# EAGLE design 3S2Pcard (EAGLE 9.5.1)

## Sheet 1 of 3
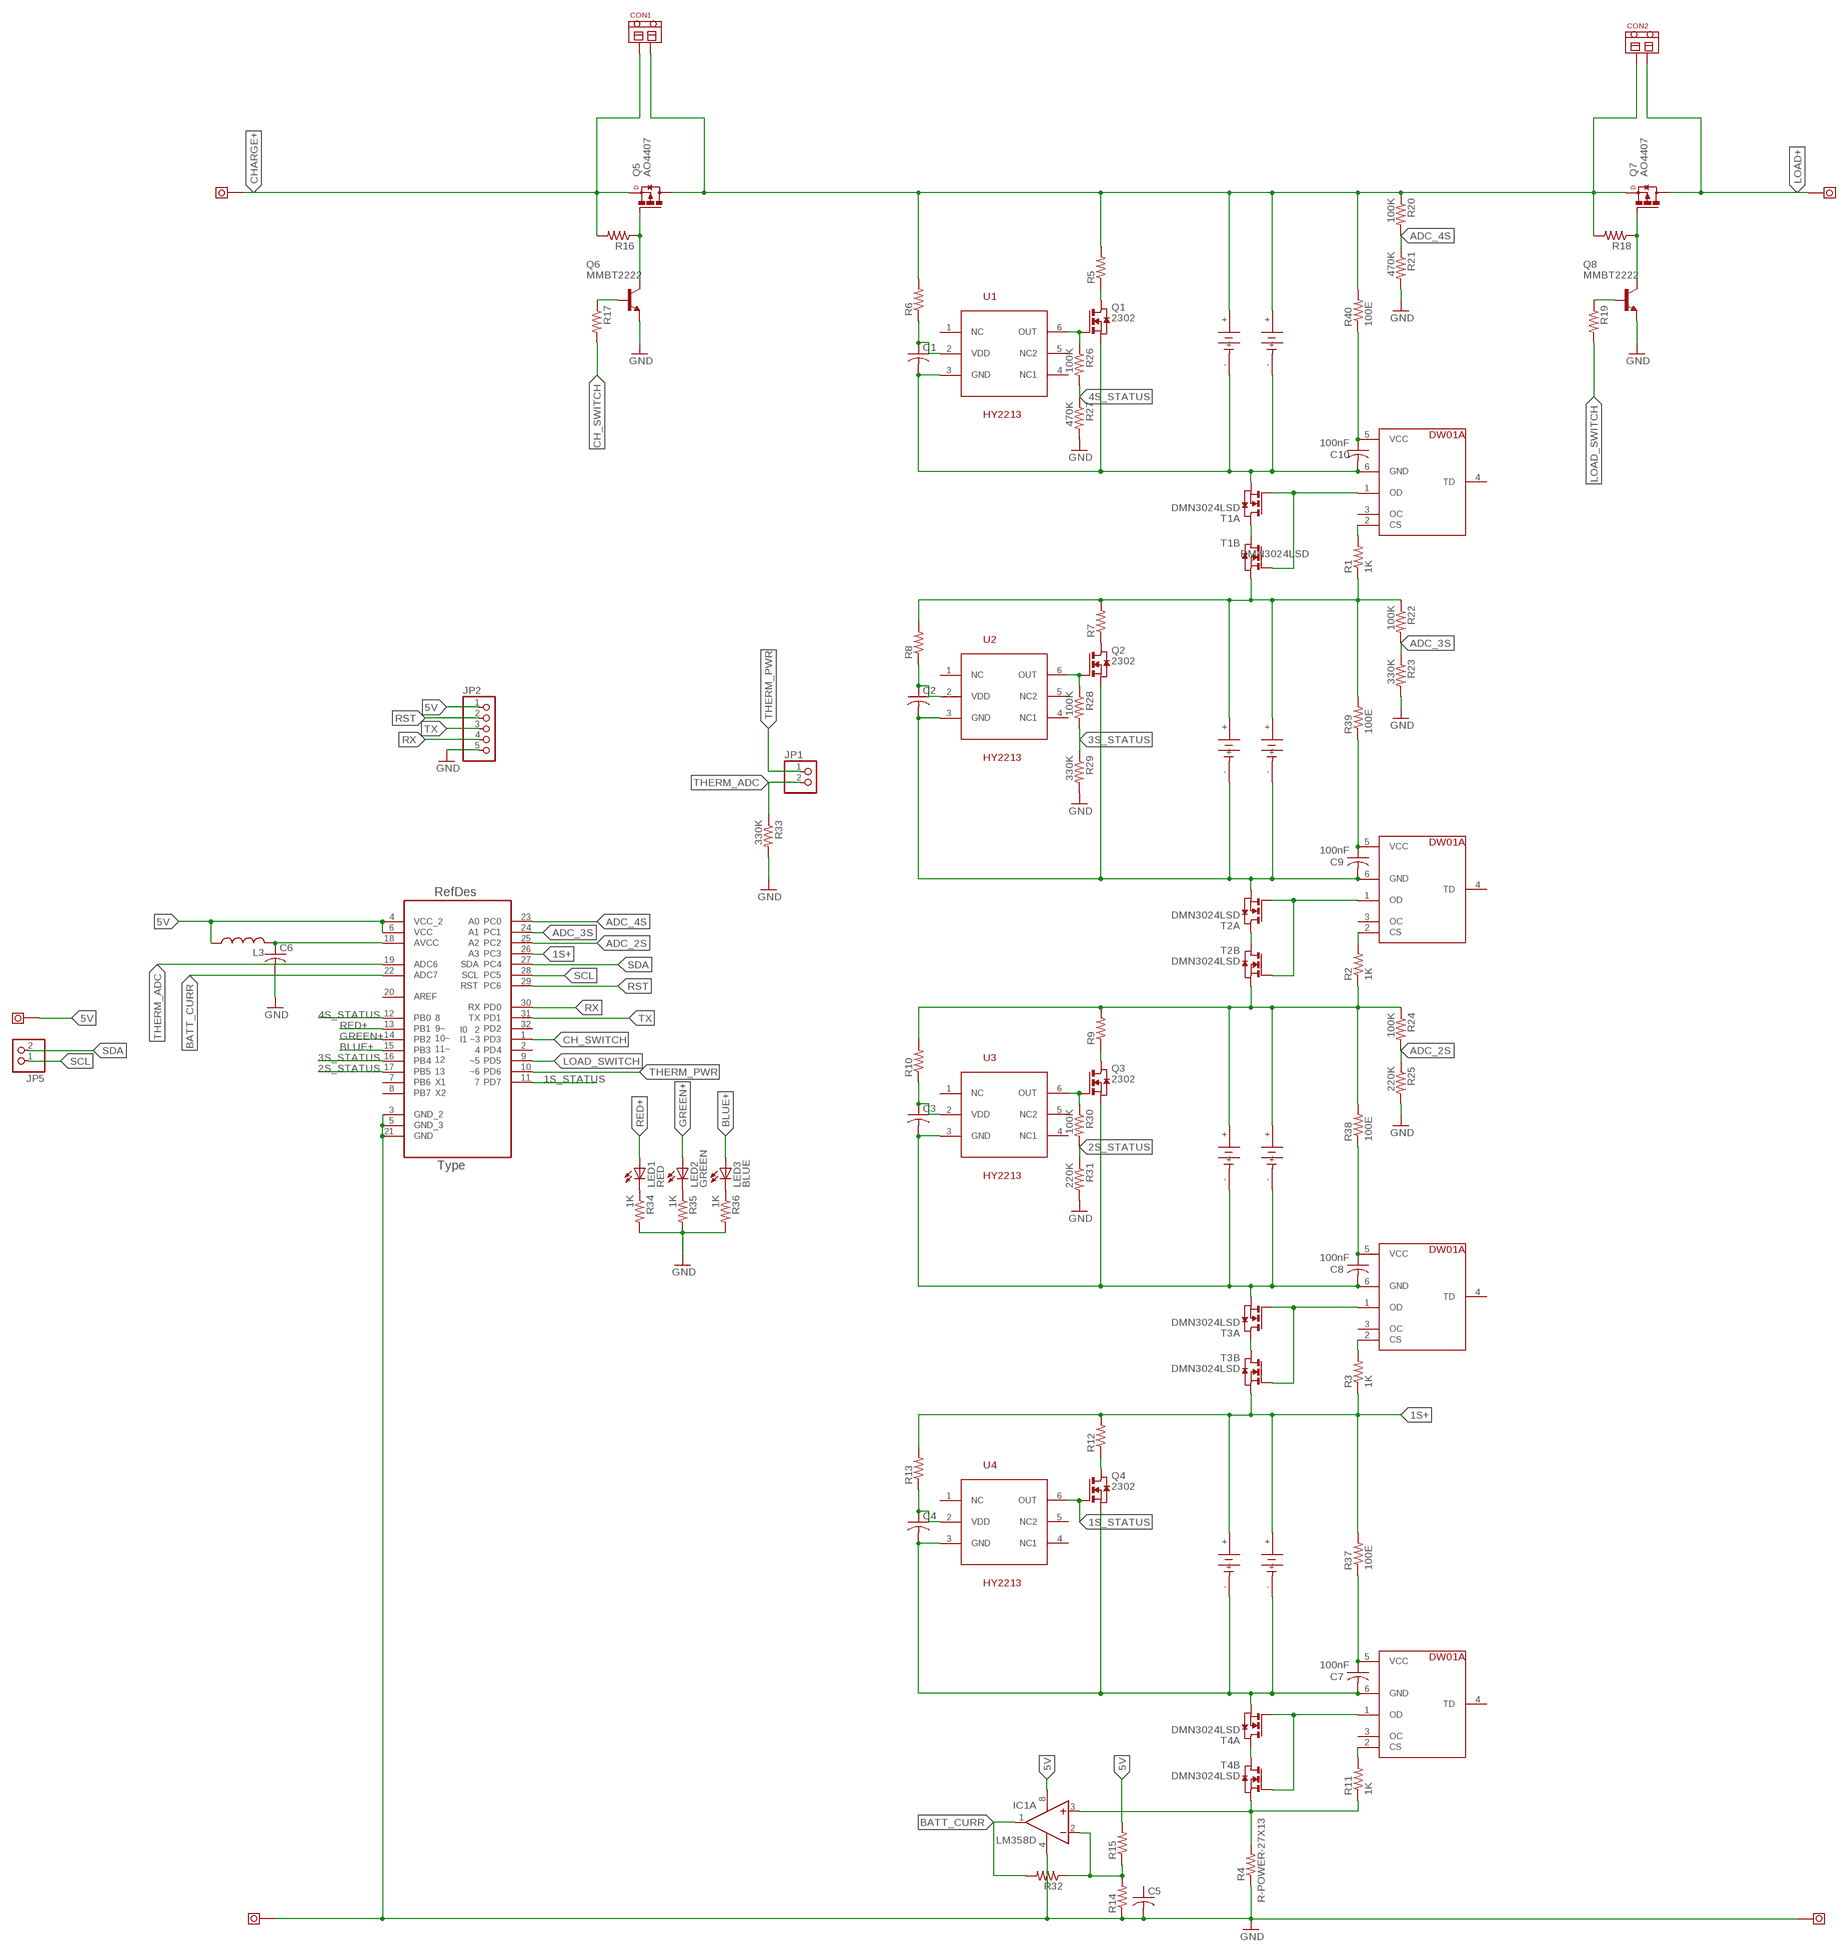
[diagram p0: schematic, sheet 1]

### Parts
B11  18650_HOLDER  [18650_HOLDER]
B12  18650_HOLDER  [18650_HOLDER]
B21  18650_HOLDER  [18650_HOLDER]
B22  18650_HOLDER  [18650_HOLDER]
B31  18650_HOLDER  [18650_HOLDER]
B32  18650_HOLDER  [18650_HOLDER]
B41  18650_HOLDER  [18650_HOLDER]
B42  18650_HOLDER  [18650_HOLDER]
C1  C-USC0805  [C0805]
C2  C-USC0805  [C0805]
C3  C-USC0805  [C0805]
C4  C-USC0805  [C0805]
C5  C-USC0805  [C0805]
C6  C-USC0805  [C0805]
C7  100nF  C-USC0805  [C0805]
C8  100nF  C-USC0805  [C0805]
C9  100nF  C-USC0805  [C0805]
C10  100nF  C-USC0805  [C0805]
CON1  TERMINAL-SMALL  [TERMINAL-SMALL]
CON2  TERMINAL-SMALL  [TERMINAL-SMALL]
IC1  LM358D  [SO08]
JP1  PINHD-1X2  [1X02]
JP2  PINHD-1X5  [1X05]
JP5  PINHD-1X2  [1X02]
L3  L-US0207/10  [0207/10]
LED1  RED  LEDCHIP-LED0805  [CHIP-LED0805]
LED2  GREEN  LEDCHIP-LED0805  [CHIP-LED0805]
LED3  BLUE  LEDCHIP-LED0805  [CHIP-LED0805]
Q1  2302  [TO236]
Q2  2302  [TO236]
Q3  2302  [TO236]
Q4  2302  [TO236]
Q5  AO4407  [SOIC8]
Q6  MMBT2222  [SOT-23-CBE]
Q7  AO4407  [SOIC8]
Q8  MMBT2222  [SOT-23-CBE]
R1  1K  R-US_R0805  [R0805]
R2  1K  R-US_R0805  [R0805]
R3  1K  R-US_R0805  [R0805]
R4  R-POWER-27X13  [R-27X13]
R5  R-US_R1206W  [R1206W]
R6  R-US_R0805  [R0805]
R7  R-US_R1206W  [R1206W]
R8  R-US_R0805  [R0805]
R9  R-US_R1206W  [R1206W]
R10  R-US_R0805  [R0805]
R11  1K  R-US_R0805  [R0805]
R12  R-US_R1206W  [R1206W]
R13  R-US_R0805  [R0805]
R14  R-US_R0805  [R0805]
R15  R-US_R0805  [R0805]
R16  R-US_R0805  [R0805]
R17  R-US_R0805  [R0805]
R18  R-US_R0805  [R0805]
R19  R-US_R0805  [R0805]
R20  100K  R-US_R0805  [R0805]
R21  470K  R-US_R0805  [R0805]
R22  100K  R-US_R0805  [R0805]
R23  330K  R-US_R0805  [R0805]
R24  100K  R-US_R0805  [R0805]
R25  220K  R-US_R0805  [R0805]
R26  100K  R-US_R0805  [R0805]
R27  470K  R-US_R0805  [R0805]
R28  100K  R-US_R0805  [R0805]
R29  330K  R-US_R0805  [R0805]
R30  100K  R-US_R0805  [R0805]
R31  220K  R-US_R0805  [R0805]
R32  R-US_R0805  [R0805]
R33  330K  R-US_R0805  [R0805]
R34  1K  R-US_R0805  [R0805]
R35  1K  R-US_R0805  [R0805]
R36  1K  R-US_R0805  [R0805]
R37  100E  R-US_R0805  [R0805]
R38  100E  R-US_R0805  [R0805]
R39  100E  R-US_R0805  [R0805]
R40  100E  R-US_R0805  [R0805]
T1  DMN3024LSD  [TSSOP-8]
T2  DMN3024LSD  [TSSOP-8]
T3  DMN3024LSD  [TSSOP-8]
T4  DMN3024LSD  [TSSOP-8]
U1  HY2213  [SOT23-6]
U2  HY2213  [SOT23-6]
U3  HY2213  [SOT23-6]
U4  HY2213  [SOT23-6]
U5  ATMEGA328P-AU  [QFP80P900X900X120-32N]
U12  DW01A  [SOT23-6]
U$7  DW01A  [SOT23-6]
U$8  DW01A  [SOT23-6]
U$9  DW01A  [SOT23-6]
U$13  METAL_SPACER  [SPACER]
U$14  METAL_SPACER  [SPACER]
U$15  METAL_SPACER  [SPACER]
U$16  METAL_SPACER  [SPACER]
U$17  METAL_SPACER  [SPACER]

### Nets
1S+: B11.+ B12.+ R3.1 R12.2 R13.2 R37.2 T3.6(B:S) T3.7(B:S) U5.26(PC3)
1S-: B11.- B12.- C4.2 C7.2 Q4.3(S) T4.2(A:S) T4.3(A:S) U4.3(GND) U12.6(GND)
1S_STATUS: Q4.2(G) U4.6(OUT) U5.11(PD7)
2S+: B21.+ B22.+ R2.1 R9.2 R10.2 R24.1 R38.2 T2.6(B:S) T2.7(B:S)
2S-: B21.- B22.- C3.2 C8.2 Q3.3(S) T3.2(A:S) T3.3(A:S) U3.3(GND) U$9.6(GND)
2S_STATUS: R30.2 R31.1 U5.17(PB5)
3S+: B31.+ B32.+ R1.1 R7.2 R8.2 R22.1 R39.2 T1.6(B:S) T1.7(B:S)
3S-: B31.- B32.- C2.2 C9.2 Q2.3(S) T2.2(A:S) T2.3(A:S) U2.3(GND) U$8.6(GND)
3S_STATUS: R28.2 R29.1 U5.16(PB4)
4S+: B41.+ B42.+ CON1.2 CON2.1 Q5.1(S) Q5.2(S) Q5.3(S) Q7.5(D) Q7.6(D) Q7.7(D) Q7.8(D) R5.2 R6.2 R18.2 R20.1 R40.2
4S-: B41.- B42.- C1.2 C10.2 Q1.3(S) T1.2(A:S) T1.3(A:S) U1.3(GND) U$7.6(GND)
4S_STATUS: R26.2 R27.1 U5.12(PB0)
5V: IC1.8(P:V+) JP2.1 L3.1 R15.2 U5.4(VCC_2) U5.6(VCC) U$17.1
ADC_2S: R24.2 R25.1 U5.25(PC2)
ADC_3S: R22.2 R23.1 U5.24(PC1)
ADC_4S: R20.2 R21.1 U5.23(PC0)
AVCC: C6.1 L3.2 U5.18(AVCC)
BATT_CURR: IC1.1(A:OUT) R32.2 U5.22(ADC7)
BLUE+: LED3.A U5.15(PB3)
CH_SWITCH: R17.2 U5.1(PD3)
CHARGE+: CON1.1 Q5.5(D) Q5.6(D) Q5.7(D) Q5.8(D) R16.2 U$15.1
GND: C5.2 C6.2 IC1.4(P:V-) JP2.5 Q6.E Q8.E R4.1 R14.1 R21.2 R23.2 R25.2 R27.2 R29.2 R31.2 R33.2 R34.2 R35.2 R36.2 U5.3(GND_2) U5.5(GND_3) U5.21(GND) U$14.1 U$16.1
GREEN+: LED2.A U5.14(PB2)
LOAD+: CON2.2 Q7.1(S) Q7.2(S) Q7.3(S) U$13.1
LOAD_SWITCH: R19.2 U5.9(PD5)
N$1: C7.1 R37.1 U12.5(VCC)
N$2: T1.1(A:D) T1.8(B:D)
N$3: C8.1 R38.1 U$9.5(VCC)
N$4: IC1.2(A:-IN) R14.2 R15.1 R32.1
N$5: T2.1(A:D) T2.8(B:D)
N$7: C9.1 R39.1 U$8.5(VCC)
N$8: C10.1 R40.1 U$7.5(VCC)
N$9: R1.2 U$7.2(CS)
N$10: T1.4(A:G) T1.5(B:G) U$7.1(OD)
N$11: R2.2 U$8.2(CS)
N$12: T3.1(A:D) T3.8(B:D)
N$14: T2.4(A:G) T2.5(B:G) U$8.1(OD)
N$15: LED1.C R34.1
N$16: LED2.C R35.1
N$17: T3.4(A:G) T3.5(B:G) U$9.1(OD)
N$18: R3.2 U$9.2(CS)
N$19: LED3.C R36.1
N$20: C1.1 R6.1 U1.2(VDD)
N$22: Q1.2(G) R26.1 U1.6(OUT)
N$23: Q1.1(D) R5.1
N$25: C2.1 R8.1 U2.2(VDD)
N$26: Q2.2(G) R28.1 U2.6(OUT)
N$27: Q2.1(D) R7.1
N$30: C3.1 R10.1 U3.2(VDD)
N$31: Q3.2(G) R30.1 U3.6(OUT)
N$32: Q3.1(D) R9.1
N$33: T4.1(A:D) T4.8(B:D)
N$34: T4.4(A:G) T4.5(B:G) U12.1(OD)
N$36: R11.2 U12.2(CS)
N$37: C4.1 R13.1 U4.2(VDD)
N$39: Q4.1(D) R12.1
N$40: IC1.3(A:+IN) R4.2 R11.1 T4.6(B:S) T4.7(B:S)
N$41: Q5.4(G) Q6.C R16.1
N$42: Q6.B R17.1
N$47: Q7.4(G) Q8.C R18.1
N$48: Q8.B R19.1
RED+: LED1.A U5.13(PB1)
RST: JP2.2 U5.29(PC6)
RX: JP2.4 U5.30(PD0)
SCL: JP5.1 U5.28(PC5)
SDA: JP5.2 U5.27(PC4)
THERM_ADC: JP1.2 R33.1 U5.19(ADC6)
THERM_PWR: JP1.1 U5.10(PD6)
TX: JP2.3 U5.31(PD1)
Unconnected: C5.1 IC1.5(B:+IN) IC1.6(B:-IN) IC1.7(B:OUT) U1.1(NC) U1.4(NC1) U1.5(NC2) U2.1(NC) U2.4(NC1) U2.5(NC2) U3.1(NC) U3.4(NC1) U3.5(NC2) U4.1(NC) U4.4(NC1) U4.5(NC2) U5.2(PD4) U5.7(PB6) U5.8(PB7) U5.20(AREF) U5.32(PD2) U12.3(OC) U12.4(TD) U$7.3(OC) U$7.4(TD) U$8.3(OC) U$8.4(TD) U$9.3(OC) U$9.4(TD)

## Sheet 2 of 3

## Sheet 3 of 3

## Library data of the parts
B11 B12 B21 B22 B31 B32 B41 B42 = drag-custom:18650_HOLDER
C1-C10 = rcl:C-US: CAPACITOR, American symbol; SPICEPREFIX: C
CON1 CON2 = drag-connectors:TERMINAL-SMALL: Small Terminal block Here is the link <http://terminals.btrworlds.com/terminal-block/connector-block-pitch-5-0-mm-22-14-awg-pcb-screw-terminal-block-connector-1404225.html>
IC1 = linear:LM358: OP AMP also LM158; LM258; LM2904 Source: http://cache.national.com/ds/LM/LM158.pdf
JP1 JP5 = pinhead:PINHD-1X2: PIN HEADER
JP2 = pinhead:PINHD-1X5: PIN HEADER
L3 = rcl:L-US: INDUCTOR, American symbol; SPICEPREFIX: L
LED1-LED3 = led:LED: LED OSRAM: - CHIPLED LG R971, LG N971, LY N971, LG Q971, LY Q971, LO R971, LY R971 LH N974, LH R974 LS Q976, LO Q976, LY Q976 LO Q996 - Hyper CHIPLED LW Q18S LB Q993, LB Q99A, LB R99A - SideLED LS A670, LO A670, LY A670, LG A670, LP A670 LB A673, LV A673, LT A673, LW A673 LH A674 LY A675 LS A676, LA A676, LO A676, LY A676, LW A676 LS A679, LY A679, LG A679 - Hyper Micro SIDELED® LS Y876, LA Y876, LO Y876, LY Y876 LT Y87S - SmartLED LW L88C, LW L88S LB L89C, LB L89S, LG L890 LS L89K, LO L89K, LY L89K LS L896, LA L896, LO L896, LY L896 - TOPLED LS T670, LO T670, LY T670, LG T670, LP T670 LSG T670, LSP T670, LSY T670, LOP T670, LYG T670 LG T671, LOG T671, LSG T671 LB T673, LV T673, LT T673, LW T673 LH T674 LS T676, LA T676, LO T676, LY T676, LB T676, LH T676, LSB T676, LW T676 LB T67C, LV T67C, LT T67C, LS T67K, LO T67K, LY T67K, LW E67C LS E67B, LA E67B, LO E67B, LY E67B, LB E67C, LV E67C, LT E67C LW T67C LS T679, LY T679, LG T679 LS T770, LO T770, LY T770, LG T770, LP T770 LB T773, LV T773, LT T773, LW T773 LH T774 LS E675, LA E675, LY E675, LS T675 LS T776, LA T776, LO T776, LY T776, LB T776 LHGB T686 LT T68C, LB T68C - Hyper Mini TOPLED® LB M676 - Mini TOPLED Santana® LG M470 LS M47K, LO M47K, LY M47K Source: http://www.osram.convergy.de LUXEON: - LUMILED® LXK2-PW12-R00, LXK2-PW12-S00, LXK2-PW14-U00, LXK2-PW14-V00 LXK2-PM12-R00, LXK2-PM12-S00, LXK2-PM14-U00 LXK2-PE12-Q00, LXK2-PE12-R00, LXK2-PE12-S00, LXK2-PE14-T00, LXK2-PE14-U00 LXK2-PB12-K00, LXK2-PB12-L00, LXK2-PB12-M00, LXK2-PB14-N00, LXK2-PB14-P00, LXK2-PB14-Q00 LXK2-PR12-L00, LXK2-PR12-M00, LXK2-PR14-Q00, LXK2-PR14-R00 LXK2-PD12-Q00, LXK2-PD12-R00, LXK2-PD12-S00 LXK2-PH12-R00, LXK2-PH12-S00 LXK2-PL12-P00, LXK2-PL12-Q00, LXK2-PL12-R00 Source: www.luxeon.com KINGBRIGHT: KA-3528ASYC Source: www.kingbright.com
Q1-Q4 = drag-semiconductors:2302
Q5 Q7 = drag-semiconductors:AO4407
Q6 Q8 = drag-semiconductors:MMBT2222
R1-R3 R5-R40 = rcl:R-US_: RESISTOR, American symbol; SPICEPREFIX: R
R4 = drag-rlcd:R-POWER-27X13
T1-T4 = FS8205A:DMN3024LSD: DUAL N-CHANNEL ENHANCEMENT MODE MOSFET data sheet <http://goo.gl/dRgboR> Dave.Calaway Eagle Library <https://goo.gl/Muy1Tr>
U1-U4 = drag-semiconductors:HY2213: Balance Charging IC
U5 = ATmega328-AU:ATMEGA328P-AU; DESCRIPTION: 8-bit Microcontroller with In-System Programmable Flash; MPN: ATMEGA328P-AU; OC_FARNELL: 1715486; OC_NEWARK: 14R4631; PACKAGE: TQFP-32; SUPPLIER: Atmel
U12 U$7-U$9 = DW01A:DW01A
U$13-U$17 = drag-custom:METAL_SPACER

## Board
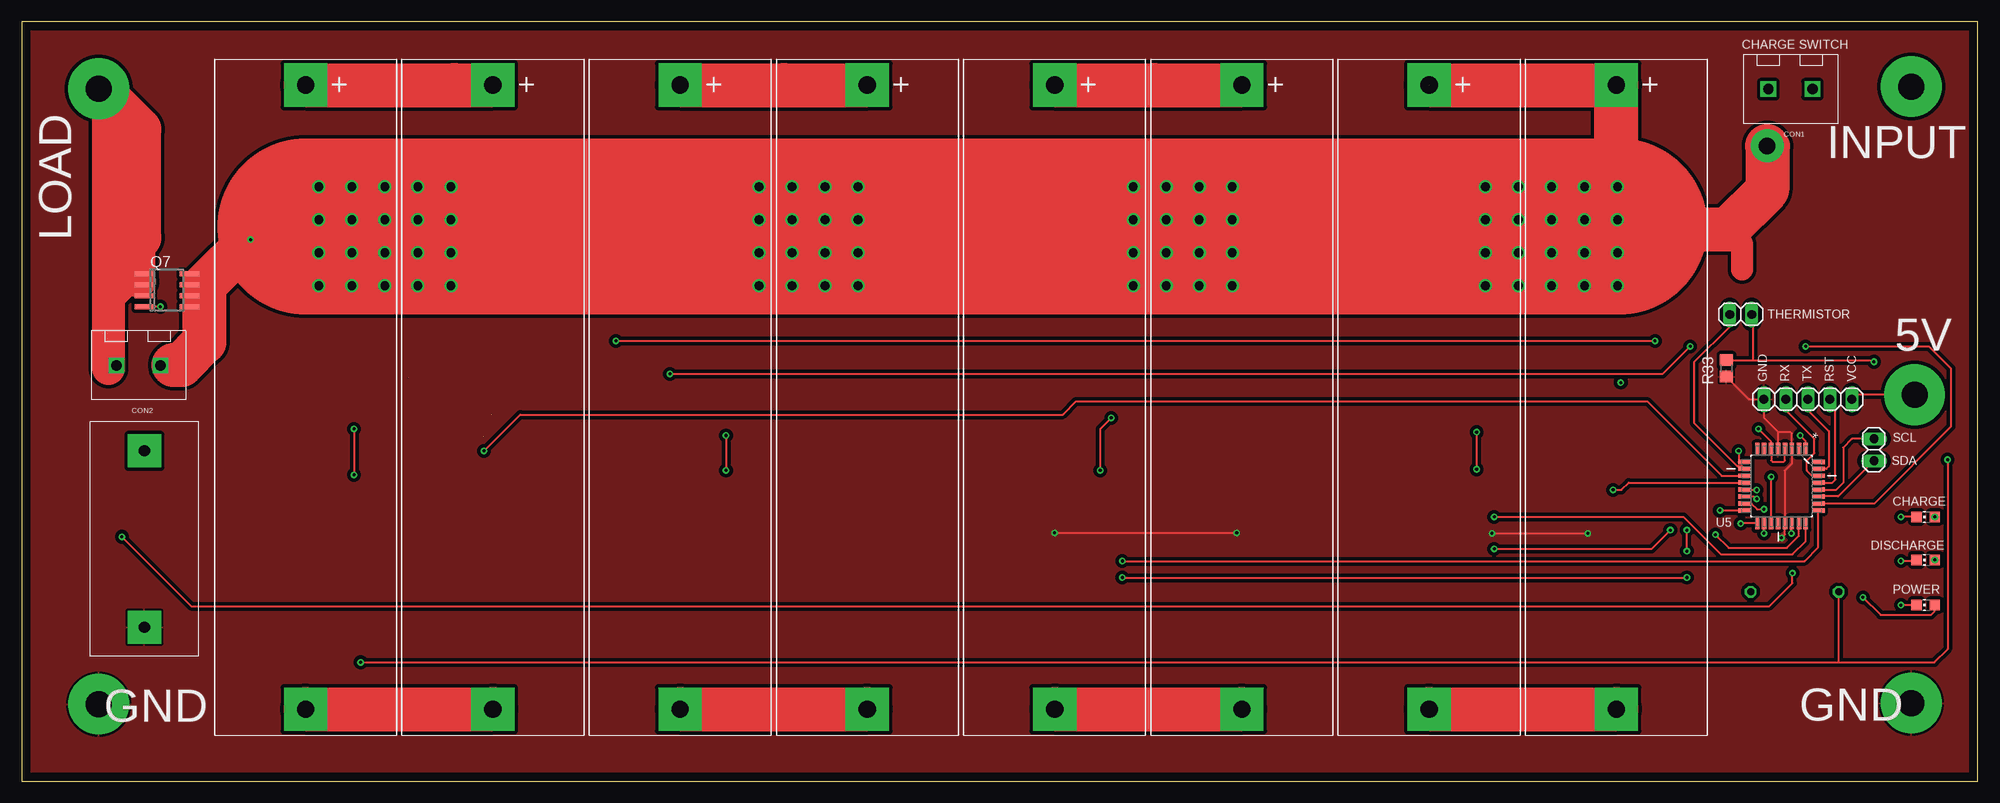
[diagram p1: board, top side]
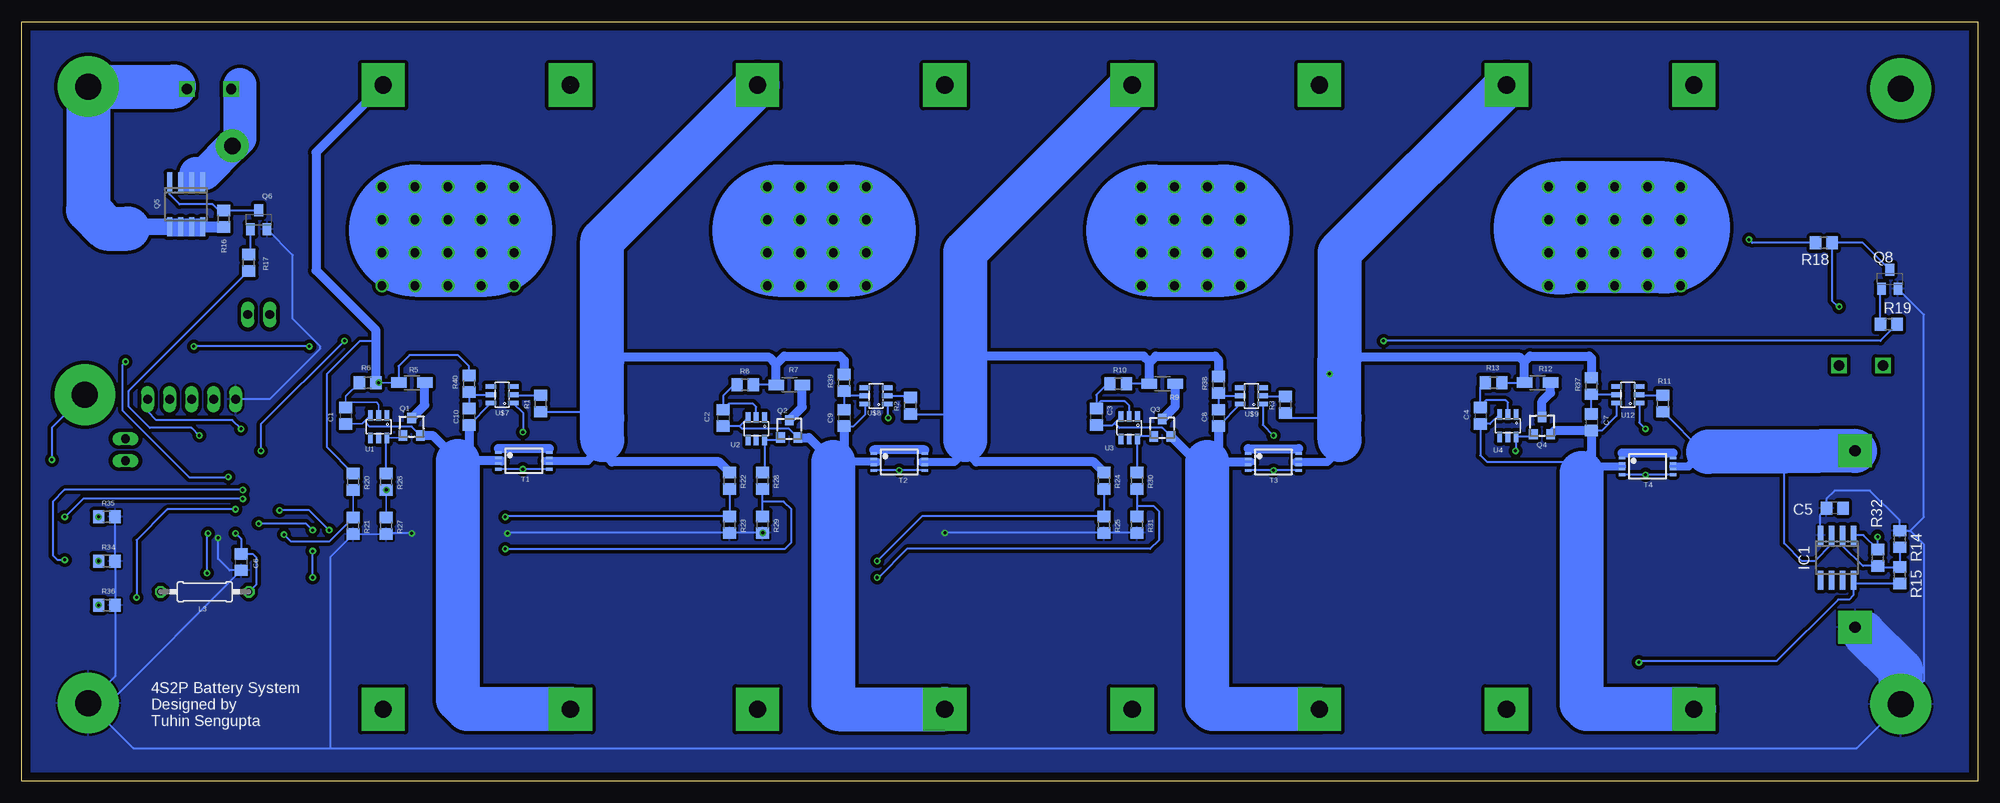
[diagram p2: board, bottom side, seen from below]

Size 225.73 x 87.62 mm. Coordinates in mm from the lower left corner, seen from the top.
Outline: 0,0 225.73,0 225.73,87.62 0,87.62 0,0
Copper layers (1*16): Top 0.035mm / dielectric 1.5mm / Bottom 0.035mm
Design rules "default": minimum track width 6mil, minimum drill 0.35mm, track to track 6mil, track to pad 6mil, pad to pad 6mil, via to via 6mil, smd to smd 6mil, copper to edge 40mil, drill to drill 6mil, minimum pad ring 10mil, minimum via ring 8mil, stop-mask expansion 4mil, vias tented up to drill 0mil, thermal gap 10mil

### Footprints (pad centres in the part's own frame; a part is rotated, then mirrored left to right if it is on the bottom)
18650_HOLDER = drill 2 pad 5 square: + -0.93,38.17; - -0.93,-33.83
C0805 = smd 1.3 x 1.5: 1 -0.95,0; 2 0.95,0
TERMINAL-SMALL = drill 1.2 square: 1 -2.165,0.165; 2 2.915,0.165
SO08 = smd 0.6 x 2.2: 1 -1.905,-2.6; 2 -0.635,-2.6; 3 0.635,-2.6; 4 1.905,-2.6; 5 1.905,2.6; 6 0.635,2.6; 7 -0.635,2.6; 8 -1.905,2.6
1X02 = drill 1.016 long: 1 -1.27,0; 2 1.27,0
1X05 = drill 1.016 long: 1 -5.08,0; 2 -2.54,0; 3 0,0; 4 2.54,0; 5 5.08,0
0207/10 = drill 0.813 octagon: 1 -5.08,0; 2 5.08,0
CHIP-LED0805 = smd 1.2 x 1.2: A 0,-1.05; C 0,1.05
TO236 = smd 1 x 1.2: 1 0,1; 2 -1,-1; 3 1,-1
SOIC8 = smd 0.6 x 2.2: 1 -1.905,-2.6; 2 -0.635,-2.6; 3 0.635,-2.6; 4 1.905,-2.6; 5 1.905,2.6; 6 0.635,2.6; 7 -0.635,2.6; 8 -1.905,2.6
SOT-23-CBE = smd 1 x 1.4: B -0.95,-1.1; C 0,1.1; E 0.95,-1.1
R0805 = smd 1.3 x 1.5: 1 -0.95,0; 2 0.95,0
R-27X13 = drill 1.27 pad 3.81 square: 1 -10.63,-0.1; 2 9.69,-0.1
R1206W = smd 1.8 x 1.2: 1 -1.499,0; 2 1.499,0
TSSOP-8 = smd 0.3 x 0.75: 1 -0.975,-2.925; 2 -0.325,-2.925; 3 0.325,-2.925; 4 0.975,-2.925; 5 0.975,2.925; 6 0.325,2.925; 7 -0.325,2.925; 8 -0.975,2.925
SOT23-6 = smd 0.55 x 1.2: 1 -0.95,-1.3; 2 0,-1.3; 3 0.95,-1.3; 4 0.95,1.3; 5 0,1.3; 6 -0.95,1.3
QFP80P900X900X120-32N = smd 1.473 x 0.508: 1 -4.242,2.794; 2 -4.242,2.007; 3 -4.242,1.194; 4 -4.242,0.406; 5 -4.242,-0.406; 6 -4.242,-1.194; 7 -4.242,-2.007; 8 -4.242,-2.794; 17 4.242,-2.794; 18 4.242,-2.007; 19 4.242,-1.194; 20 4.242,-0.406; 21 4.242,0.406; 22 4.242,1.194; 23 4.242,2.007; 24 4.242,2.794 | smd 0.508 x 1.473: 9 -2.794,-4.242; 10 -2.007,-4.242; 11 -1.194,-4.242; 12 -0.406,-4.242; 13 0.406,-4.242; 14 1.194,-4.242; 15 2.007,-4.242; 16 2.794,-4.242; 25 2.794,4.242; 26 2.007,4.242; 27 1.194,4.242; 28 0.406,4.242; 29 -0.406,4.242; 30 -1.194,4.242; 31 -2.007,4.242; 32 -2.794,4.242
SPACER = drill 3 pad 7: 1 0,0

### Placement (x,y rotation side)
B11  55.3,42.13 0 top
B12  33.7,42.13 0 top
B21  98.52,42.13 0 top
B22  76.91,42.13 0 top
B31  141.74,42.13 0 top
B32  120.13,42.13 0 top
B41  163.34,42.13 0 top
B42  184.95,42.13 0 top
C1  188.34,42.16 270 bottom
C2  144.78,41.91 270 bottom
C3  101.73,42.04 270 bottom
C4  57.4,42.16 270 bottom
C5  16.51,31.5 180 bottom
C6  200.41,25.27 270 bottom
C7  44.58,41.4 270 bottom
C8  87.63,41.91 270 bottom
C9  130.81,41.91 270 bottom
C10  174.12,42.04 270 bottom
CON1  204.47,80.01 180 top
CON2  13.84,48.13 180 top
IC1  16.26,25.78 180 bottom
JP1  198.37,53.85 0 top
JP2  206.12,44.07 180 top
JP5  213.74,38.23 270 top
L3  204.6,21.84 0 bottom
LED1  219.71,25.53 90 top
LED2  219.71,30.48 90 top
LED3  219.71,20.32 90 top
Q1  180.72,40.89 0 bottom
Q2  137.16,40.64 0 bottom
Q3  94.11,40.77 0 bottom
Q4  50.29,41.02 0 bottom
Q5  206.76,66.55 180 bottom
Q6  198.37,64.77 0 bottom
Q7  16.76,56.64 270 top
Q8  10.16,57.91 0 bottom
R1  165.86,43.56 90 bottom
R2  123.19,43.31 90 bottom
R3  79.88,43.43 90 bottom
R4  14.07,28.41 90 top
R5  180.72,45.97 180 bottom
R6  185.8,45.97 0 bottom
R7  137.16,45.72 180 bottom
R8  142.24,45.72 0 bottom
R9  94.11,45.85 180 bottom
R10  99.19,45.85 0 bottom
R11  36.32,43.56 90 bottom
R12  50.8,45.97 180 bottom
R13  55.88,45.97 0 bottom
R14  9.02,27.94 270 bottom
R15  9.02,23.75 270 bottom
R16  202.44,64.9 270 bottom
R17  199.52,59.82 270 bottom
R18  17.78,62.1 180 bottom
R19  10.29,52.7 0 bottom
R20  187.45,34.54 270 bottom
R21  187.45,29.46 270 bottom
R22  144.02,34.67 270 bottom
R23  144.02,29.59 270 bottom
R24  100.84,34.67 270 bottom
R25  100.84,29.59 270 bottom
R26  183.64,34.54 270 bottom
R27  183.64,29.46 270 bottom
R28  140.21,34.67 270 bottom
R29  140.21,29.59 270 bottom
R30  97.03,34.67 270 bottom
R31  97.03,29.59 270 bottom
R32  11.56,25.78 90 bottom
R33  196.72,47.62 270 top
R34  215.9,25.4 0 bottom
R35  215.9,30.48 0 bottom
R36  215.9,20.32 0 bottom
R37  44.58,45.59 90 bottom
R38  87.63,45.72 90 bottom
R39  130.81,45.97 90 bottom
R40  174.12,45.85 90 bottom
T1  167.77,36.96 270 bottom
T2  124.46,36.83 270 bottom
T3  81.28,36.83 270 bottom
T4  38.1,36.32 270 bottom
U1  184.53,40.89 180 bottom
U2  140.97,40.64 180 bottom
U3  97.92,40.77 180 bottom
U4  54.23,41.02 180 bottom
U5  203.07,34.04 270 top
U12  40.39,44.58 90 bottom
U$7  170.31,44.58 90 bottom
U$8  127.13,44.45 90 bottom
U$9  83.82,44.45 90 bottom
U$13  8.89,79.88 0 top
U$14  218.06,9.02 0 top
U$15  218.06,80.14 0 top
U$16  8.89,8.89 0 top
U$17  218.44,44.58 0 top

### Tracks (layer width: path | path; a pad name or v marks a point on that pad's centre or on a via)
1S+  (via drill 0.35)  (1 unrouted)
  Top 0.203: v74.8,46.99 189.36,46.99 v192.53,50.16 | v205.87,50.16 220.09,50.16 222.63,47.62 222.63,40.89 213.77,32.03 U5.26
  Top 0.94: 49.91,80.14 49.91,80.3
  Top 5.08: B12.+ 49.91,80.3 B11.+
  Bottom 0.203: R12.2 R13.2 54.93,46.42 | 43.88,45.85 R37.2 44.58,46.86 44.58,47.12 | 79.88,42.16 R3.1 79.31,41.91 73.66,41.91 | 78.03,36.83 77.47,36.83 | 78.03,36.83 T3.7 | 78.03,36.83 T3.6 | v192.53,50.16 v205.87,50.16
  Bottom 0.94: 78.74,36.83 77.47,36.83 75.06,36.83 73.66,38.23 73.66,39.37
  Bottom 1.016: 34.52,78.55 B12.+ | R12.2 52.3,48.36 | 52.3,48.36 52.83,48.9 73.53,48.9 73.66,48.77 74.8,47.62 v74.8,46.99 | 52.3,48.36 52.3,48.41 51.69,49.02 44.83,49.02 44.58,48.77 44.58,46.86
  Bottom 5.08: B11.+ 73.66,61.01 73.66,48.77 73.66,41.91 73.66,39.37
1S-
  Top 5.08: B12.- B11.-
  Bottom 0.203: T4.2 41.02,36.32 T4.3 | 44.48,37.82 44.61,37.94 44.77,38.1 | U4.3 56.29,41.21 C4.2 57.4,37.59 56.64,36.83 47.5,36.83 47.24,37.08 47.12,37.08 45.72,35.69 | U12.6 41.69,42.13 43.37,40.45 C7.2
  Bottom 0.94: 44.58,36.07 44.32,36.32 41.02,36.32
  Bottom 1.016: 44.58,36.83 C7.2 48.86,40.45 Q4.3 | 44.58,36.83 44.58,36.07 | 45.72,35.56 45.72,35.69 | 45.72,35.69 44.58,36.83 | 45.72,35.69 45.72,36.83 44.61,37.94
  Bottom 5.08: B12.- 45.13,8.3 45.72,8.89 45.72,35.56
1S_STATUS  (via drill 0.35)  (1 unrouted)
  Top 0.203: v53.34,38.1 57.53,42.29 120.14,42.29 121.67,43.81 187.58,43.81 196.16,35.23 U5.11
  Bottom 0.203: Q4.2 51.55,39.77 53.23,39.77 U4.6 53.28,38.16 v53.34,38.1
2S+
  Top 0.94: 87.92,80.3 87.63,80.01 88.52,79.12 94.11,79.12
  Top 5.08: B22.+ B21.+ 87.92,80.3
  Bottom 0.203: R9.2 R10.2 | 87.19,46.23 R38.2 | T2.6 121.21,36.83 T2.7 121.59,37.16 121.92,36.83 | 122.74,41.91 R2.1 117.66,42.36 116.84,43.18
  Bottom 0.94: 116.84,39.37 116.84,38.1 118.11,36.83 121.92,36.83
  Bottom 1.016: 77.7,78.58 B22.+ | R9.2 95.61,48.26 | 95.61,48.26 95.61,48.36 96.27,49.02 116.71,49.02 116.84,48.9 | 95.61,48.26 94.84,49.02 88.01,49.02 87.63,48.64 R38.2 | R24.1 102.05,36.83 115.57,36.83 116.84,38.1
  Bottom 5.08: 116.84,39.37 116.84,43.18 116.84,48.9 116.84,61.05 B21.+
2S-
  Top 5.08: B22.- B21.-
  Bottom 0.203: U3.3 99.61,41.32 | 99.61,41.32 99.91,41.02 101.66,41.02 | 101.66,41.02 C3.2 | 101.73,40.95 101.66,41.02 | U$9.6 85.12,43.47 C8.2 | 84.53,36.83 T3.2 | 84.58,36.83 84.53,36.83 | 84.53,36.83 T3.3 | Q3.3 94.11,40.77 99.06,40.77 99.61,41.32
  Bottom 0.889: 84.58,36.83 83.82,36.83
  Bottom 1.016: 75.2,9.08 B22.- | C8.2 87.63,36.83 | B21.- 99.06,9.77 | 87.63,36.83 88.9,36.83 90.17,36.83 Q3.3 | 87.63,36.83 84.58,36.83
  Bottom 5.08: B22.- 88.31,8.3 88.9,8.89 88.9,36.83
2S_STATUS  (via drill 0.35)
  Top 0.203: v127,23.5 v192.15,23.5 192.28,23.5 | v192.15,26.54 v192.15,28.96 | v198.37,29.72 198.45,29.79 U5.17
  Bottom 0.203: R30.2 97.03,31.75 | 97.03,31.75 R31.1 | v127,23.5 126.87,23.5 123.57,26.8 95.5,26.8 94.49,27.81 94.49,31.11 95.12,31.75 97.03,31.75 | v192.15,23.5 v192.15,26.54 | v192.15,28.96 192.91,29.72 v198.37,29.72
3S+
  Top 0.94: 135.09,80.3 130.68,80.3
  Top 5.08: B32.+ 130.68,80.3 B31.+
  Bottom 0.203: R7.2 R8.2 | 164.77,36.96 163.96,36.96 164.28,37.28 T1.7 | 164.77,36.96 164.84,37.03 T1.7 | 164.77,36.96 164.84,36.89 T1.6 | R1.1 159.45,42.61 158.75,41.91 | T1.7 165.03,37.28 165.35,36.96 | T1.7 164.77,37.21 164.77,36.96
  Bottom 0.94: 165.35,36.96 164.77,36.96 163.96,36.96 160.4,36.96 158.75,38.61 158.75,39.37
  Bottom 1.016: 120.88,78.62 B32.+ | 142.47,78.64 B31.+ | R7.2 138.66,48.11 | 138.66,48.11 139.45,48.9 158.37,48.9 158.75,48.51 | 138.66,48.11 137.75,49.02 131.32,49.02 130.81,48.51 R39.2 | R22.1 145.23,36.83 157.61,36.83 158.75,37.97 158.75,39.37
  Bottom 5.08: B31.+ 158.75,62.36 158.75,48.51 158.75,41.91 158.75,39.37
3S-
  Top 5.08: B32.- B31.-
  Bottom 0.203: U2.3 142.9,40.96 | 142.9,40.96 C2.2 | U$8.6 128.43,42.26 129.79,40.89 130.74,40.89 C9.2 | Q2.3 137.16,40.64 142.58,40.64 142.9,40.96 | 127,36.83 127.06,36.83 T2.2 T2.3
  Bottom 0.94: 132.08,36.83 130.81,36.83 127,36.83
  Bottom 1.016: 118.38,9.12 B32.- | C9.2 130.81,36.83 | 139.97,9.14 B31.- | Q2.3 134.89,39.64 132.08,36.83
  Bottom 3.81: 132.08,8.89 131.49,8.3
  Bottom 5.08: 132.08,36.83 132.08,8.89 | 131.49,8.3 B32.-
3S_STATUS  (via drill 0.35)
  Top 0.203: v169.93,26.8 188.09,26.8 v190.25,28.96 | v195.96,31.24 U5.16
  Bottom 0.203: R29.1 140.21,32.26 | 140.21,32.26 R28.2 | v190.25,28.96 192.53,31.24 v195.96,31.24 | v169.93,26.8 137.67,26.8 136.91,27.56 136.91,31.37 137.79,32.26 140.21,32.26
4S+  (via drill 0.35, 1.91 pad 3.81)  (1 unrouted)
  Top 0.203: 21.08,56.9 21.08,57.15 21.08,58.67 19.49,58.67 Q7.8 Q7.7 Q7.6 Q7.5 | v26.42,62.48 31.24,62.48 32.77,64.01 | 17.53,48.01 16.05,48.01 CON2.1
  Top 2.54: 196.85,63.63 198.5,61.98 198.5,59.05
  Top 20.32: 32.77,64.01 178.05,64.01 184.4,64.01
  Top 3.81: v201.42,73.28 202.18,73.28
  Top 5.08: B41.+ B42.+ | 21.08,56.9 21.08,50.67 18.41,48.01 17.53,48.01 | B42.+ 184.02,70.48 190.88,63.63 196.85,63.63 201.42,68.2 v201.42,73.28 | 21.08,57.15 v26.42,62.48 | 178.05,64.01 184.02,69.98 B42.+
  Bottom 0.152: R5.2 v184.53,45.97 R6.2
  Bottom 0.203: 174.06,46.74 R40.2 174.12,47.88 175.39,49.15 180.97,49.15 182.25,47.88 182.25,46 R5.2 | v26.42,62.48 26.04,62.1 R18.2 | R20.1 190.5,38.54 190.5,46.99 186.69,50.8 184.85,50.8 | Q5.1 204.85,69.85 204.6,70.1 205.16,70.1 Q5.2 Q5.3 | 200.53,80.39 201.01,80.39 CON1.2
  Bottom 1.016: 164.06,78.66 B41.+ | R6.2 184.85,50.8 184.85,52.01 191.77,58.93 191.77,72.55 B42.+ 184.85,79.47
  Bottom 3.81: v201.42,73.28 204.6,70.1 205.61,70.1 | v201.42,73.28 200.91,73.79 | v201.42,73.28 200.53,74.17 200.53,80.39
4S-
  Top 5.08: B41.- B42.-
  Bottom 0.152: U1.3 186.16,41.51 186.46,41.21 C1.2
  Bottom 0.203: U$7.6 171.61,43.6 C10.2 | T1.2 170.63,37.28 170.31,36.96 170.63,36.63 T1.3 | Q1.3 180.72,40.89 185.55,40.89 186.16,41.51
  Bottom 1.016: C10.2 174.12,36.96 | 170.31,36.96 174.12,36.96 | 174.12,36.96 175.39,36.96 178.32,39.89 Q1.3
  Bottom 5.08: B41.- 174.29,8.3 175.39,9.4 175.39,36.96
4S_STATUS  (via drill 0.35)
  Top 0.203: R26.2 184.6,33.59 185.44,34.44 U5.12
  Bottom 0.152: R26.2 R27.1
  other vias: 183.64,33.59
5V  (via drill 0.35)
  Top 0.203: U$17.1 211.71,44.58 JP2.1 | U5.4 203.48,36.98 203.33,36.83 202.06,36.83 201.88,37.01 U5.6 201.88,39.17 v200.41,40.64 | v39.12,13.72 209.68,13.72 | 209.68,13.72 220.73,13.72 222.25,15.24 v222.25,37.08 | 209.68,13.72 L3.1
  Bottom 0.203: R15.2 13.97,22.8 IC1.8 14.35,21.46 14.86,20.95 16.13,20.95 23.2,13.88 23.2,13.84 39.12,13.84 v39.12,13.72 | v200.41,40.64 201.42,41.66 210.19,41.66 211.2,42.67 JP2.1 | U$17.1 222.25,40.77 v222.25,37.08
ADC_2S  (via drill 0.35)
  Top 0.203: v127,25.4 205.74,25.4 207.31,26.98 U5.25
  Bottom 0.203: R24.2 R25.1 121.86,30.54 v127,25.4
ADC_3S  (via drill 0.35)
  Top 0.203: v169.93,30.48 191.77,30.48 196.09,26.16 204.34,26.16 205.87,27.69 U5.24
  Bottom 0.203: R22.2 R23.1 169.87,30.54 v169.93,30.48
ADC_4S  (via drill 0.35)
  Top 0.203: 205.1,29.77 U5.23 205.08,28.3 203.71,26.92 196.98,26.92 v195.45,28.45
  Bottom 0.152: R21.1 R20.2
  Bottom 0.203: v195.45,28.45 194.69,27.69 190.18,27.69 R21.1
AVCC  (via drill 0.35)
  Top 0.203: v201.04,28.57 201.04,29.77 U5.18
  Bottom 0.203: v201.04,28.57 200.41,27.94 C6.1 200.34,26.16 199.01,26.16 198.63,25.78 198.63,22.73 L3.2
BATT_CURR  (via drill 0.35)
  Top 0.203: v11.56,28.19 19.56,20.19 201.68,20.19 204.34,22.86 v204.34,24 | v204.22,28.57 204.22,29.74 U5.22
  Bottom 0.203: 14.35,27.81 IC1.1 13.21,28.38 R32.2 v11.56,28.19 | v204.34,24 204.34,28.45 v204.22,28.57
BLUE+  (via drill 0.35)
  Top 0.203: U5.15 199.62,32.03 200.28,31.37 v201.04,31.37 | v212.47,21.21 214.5,19.18 220.34,19.18 220.76,19.59 LED3.A
  Bottom 0.203: v201.04,31.37 208.91,31.37 212.47,27.81 v212.47,21.21
CH_SWITCH  (via drill 0.35)
  Top 0.203: U5.1 205.87,39.24 v205.23,39.88
  Bottom 0.203: v205.23,39.88 206.12,40.77 210.95,40.77 213.36,43.18 213.36,45.02 R17.2
CHARGE+
  Bottom 0.203: 208.15,80.14 206.93,80.14 CON1.1
  Bottom 1.016: Q5.7 Q5.8
  Bottom 1.27: Q5.5 Q5.6 Q5.7 | Q5.8 R16.2
  Bottom 1.905: Q5.5 212.28,63.95 212.72,64.39 212.72,64.52
  Bottom 2.54: 215.9,63.75 212.48,63.75 212.28,63.95
  Bottom 3.81: U$15.1 217.3,79.38
  Bottom 5.08: 213.49,63.75 215.9,63.75 218.06,65.91 U$15.1 208.15,80.14
GND  (via drill 0.35)
  Top 0.203: 202.67,40.26 202.67,40.28 201.04,41.91 JP2.5 199.33,44.07 R33.2 | 202.67,40.26 U5.5 | 202.67,40.26 204.09,40.26 204.27,40.08 U5.3 204.27,36.63 203.45,35.81 203.45,29.82 U5.21 203.48,28.47 v203.07,28.07 | v169.67,28.57 v180.72,28.57 | v119.19,28.64 140.14,28.64 140.21,28.57 R29.2
  Bottom 0.152: R27.2 183.77,28.51 R21.2
  Bottom 0.203: R31.2 R25.2 119.06,28.64 119.13,28.7 v119.19,28.64 | IC1.4 18.16,30.8 C5.2 17.46,32.58 16.51,33.53 12.45,33.53 9.02,30.1 R14.1 7.81,28.89 | 7.81,28.89 7.11,28.19 | 7.11,28.19 6.22,27.3 6.22,11.56 U$16.1 13.97,3.81 190.12,3.81 | Q8.E 6.22,53.83 6.22,30.48 7.81,28.89 | 6.99,28.32 7.11,28.19 | R29.2 R23.2 | R23.2 144.08,28.64 | v203.07,28.07 203.07,25.65 201.74,24.32 C6.2 215.71,9.02 U$14.1 | U$14.1 212.85,3.81 190.12,3.81 | R21.2 190.12,25.85 190.12,3.81 | R23.2 169.61,28.64 v169.67,28.57 | v180.72,28.57 183.71,28.57 183.77,28.51 | R35.2 R34.2 R36.2 214.95,12.13 U$14.1 | JP2.5 197.1,44.07 191.26,49.91 191.26,50.16 194.44,53.34 194.44,60.68 Q6.E | 13.21,17.14 13.84,17.78 R4.1
  Bottom 5.08: U$16.1 8.89,12.83 13.21,17.14
  other vias: 140.21,28.64
  pour Bottom (isolate 0.406): 0,87.63 226.06,87.63 226.06,0 0,0
  pour Top (isolate 0.406): 0,87.63 226.06,87.63 226.06,0 0,0
GREEN+  (via drill 0.35)
  Top 0.203: U5.14 199.82,32.84 200.15,32.51 v200.22,32.58
  Bottom 0.203: v200.22,32.58 218.63,32.58 220.73,30.48 LED2.A
  other vias: 220.76,30.48
LOAD+
  Top 0.203: Q7.1 Q7.2 Q7.3 11.05,56.01 10.54,56.52 10.54,55.5 10.99,55.05 | 10.03,47.62 10.59,47.62 CON2.2
  Top 1.27: 13.59,57.66 10.99,55.05 9.65,53.72 9.53,53.72
  Top 3.81: 13.59,57.66 13.59,62.74 | U$13.1 10.03,78.74 10.03,47.62
  Top 5.08: 13.59,62.74 13.59,75.18 U$13.1
LOAD_SWITCH  (via drill 0.35)
  Top 0.203: v68.58,50.8 v188.47,50.8 | v198.12,38.1 198.12,36.83 U5.9
  Bottom 0.203: R19.2 11.24,50.8 v68.58,50.8 | v188.47,50.8 198.12,41.15 v198.12,38.1
N$1
  Bottom 0.203: C7.1 R37.1 44.51,44.58 U12.5
N$2
  Bottom 0.203: T1.8 164.85,38.35 | T1.1 170.69,38.35 170.69,38.48
  Bottom 1.016: 164.85,38.35 170.69,38.35
N$3
  Bottom 0.203: R38.1 87.63,44.45 | 87.63,44.45 C8.1 | 87.63,44.45 U$9.5
N$4
  Bottom 0.203: R14.2 R15.1 11.43,24.7 R32.1 13.27,24.83 15.62,27.18 IC1.2
N$5
  Bottom 0.203: T2.1 127.39,38.23 127.39,38.35 127.38,38.35 | T2.8 121.53,38.1 | 121.53,38.1 121.53,38.23 121.53,38.6 121.54,38.61 | 121.53,38.1 121.54,38.1
  Bottom 1.016: 121.53,38.23 127.39,38.23
N$6
  Bottom 15.24: 36.2,63.88 48.13,63.88 48.26,63.75
N$7
  Bottom 0.203: 130.43,44.45 130.81,44.83 R39.1 130.81,44.45 | 130.81,44.45 C9.1 | U$8.5 130.81,44.45
N$8
  Bottom 0.203: R40.1 174.12,44.58 | 174.12,44.58 C10.1 | 174.12,44.58 U$7.5
N$9
  Bottom 0.203: U$7.2 168.94,44.51 R1.2
N$10  (via drill 0.35)
  Top 0.203: v167.89,40.26 v167.89,35.98
  Bottom 0.203: T1.5 v167.89,35.98 T1.4 | U$7.1 167.89,42.51 v167.89,40.26
N$11
  Bottom 0.203: 123.89,44.26 R2.2 123.38,44.45 U$8.2
N$12
  Bottom 0.203: T3.8 78.36,38.35 | T3.1 84.2,38.35
  Bottom 1.016: 84.2,38.35 78.36,38.35
N$13
  Bottom 15.24: 95.25,63.5 87,63.5
N$14  (via drill 0.35)
  Top 0.203: v124.46,35.85 124.46,40.64 v125.73,41.91
  Bottom 0.203: T2.5 v124.46,35.85 T2.4 | v125.73,41.91 125.73,43.4 U$8.1
N$15  (via drill 0.35)
  Top 0.203: LED1.C 218.53,25.4 R34.1
  other vias: 216.85,25.4
N$16  (via drill 0.35)
  Top 0.203: LED2.C R35.1
  other vias: 216.85,30.48
N$17  (via drill 0.35)
  Top 0.203: v81.28,39.88 v81.28,35.85
  Bottom 0.203: T3.5 v81.28,35.85 T3.4 | U$9.1 82.52,41.12 v81.28,39.88
N$18
  Bottom 0.203: U$9.2 82.45,44.38 R3.2
N$19  (via drill 0.35)
  Top 0.203: LED3.C R36.1
  other vias: 216.85,20.32
N$20
  Bottom 0.152: R6.1 188.34,44.38 188.34,43.43 | 188.34,43.43 C1.1 | U1.2 184.53,43.43 184.78,43.69 188.09,43.69 188.34,43.43
N$21
  Bottom 15.24: 138.43,63.5 130.18,63.5
N$22
  Bottom 0.152: Q1.2 182.02,39.59 U1.6
  Bottom 0.203: R26.1 183.64,39.53 U1.6
N$23
  Bottom 0.203: R5.1 179.07,45.97
  Bottom 1.016: Q1.1 179.22,43.39 R5.1
N$24
  Bottom 15.24: 180.34,63.5 172.09,63.5
N$25
  Bottom 0.203: R8.1 143.51,45.72 144.78,44.45 C2.1 144.78,42.93 144.15,43.56 141.35,43.56 140.97,43.18 U2.2
N$26
  Bottom 0.203: Q2.2 138.46,39.34 U2.6 140.02,35.81 R28.1
N$27
  Bottom 1.016: Q2.1 135.66,43.14 R7.1
N$29  (via drill 1)
  other vias: 34.29,68.58
N$30
  Bottom 0.203: R10.1 100.46,45.85 101.73,44.58 101.73,43.31 | 101.73,43.31 C3.1 | U3.2 97.92,43.31 98.42,43.81 101.22,43.81 101.73,43.31
N$31
  Bottom 0.203: Q3.2 96.67,39.77 U3.6 96.97,35.68 R30.1
N$32
  Bottom 1.016: Q3.1 92.61,43.27 R9.1
N$33
  Bottom 0.203: T4.8 35.17,37.84 | T4.1 41.02,37.84
  Bottom 0.356: 35.17,37.84 35.18,37.85 | 41.02,37.84 41.02,37.85
  Bottom 1.016: 35.17,37.84 41.02,37.84
N$34  (via drill 0.35)
  Top 0.203: v38.35,40.64 v38.35,35.35
  Bottom 0.203: T4.5 v38.35,35.35 T4.4 | U12.1 39.09,41.37 v38.35,40.64
N$35  (via drill 1)
  other vias: 38.1,68.58
N$36
  Bottom 0.203: U12.2 39.02,44.51 R11.2
N$37  (1 unrouted)
  Bottom 0.203: 54.26,42.32 U4.2 54.23,43.69 54.48,43.94 56.77,43.94 57.4,43.31 | C4.1 57.4,43.31 | 57.4,43.31 57.4,45.4 R13.1
N$38  (via drill 1)
  other vias: 41.91,68.58
N$39
  Bottom 1.016: Q4.1 50.29,43.81 49.3,44.81 R12.1
N$40
  Bottom 0.203: T4.7 35.17,36.32 T4.6 | 36.32,42.04 R11.1 31.71,38.01 | 34.54,36.32 34.04,36.32 | IC1.3 16.89,27.3 18.8,25.4 20.32,25.4 22.35,27.43 22.35,38.01
  Bottom 0.94: 35.17,36.32 34.54,36.32 33.4,36.32 31.71,38.01 31.08,38.01
  Bottom 5.08: R4.2 22.35,38.01 31.08,38.01 31.11,37.97
N$41
  Bottom 0.203: Q5.4 208.66,67.69 207.52,66.55 203.71,66.55 203.01,65.85 R16.1 198.4,65.85 Q6.C
  Bottom 0.508: 198.37,66.17 Q6.C
N$42
  Bottom 0.203: R17.1 199.32,60.96 Q6.B
N$43  (via drill 1)
  other vias: 45.72,68.58
N$44  (via drill 1)
  other vias: 49.53,68.58
N$45  (via drill 1)
  other vias: 49.53,64.77
N$47  (via drill 0.35)
  Top 0.203: v16,54.74 Q7.4
  Bottom 0.203: v16,54.74 16.13,54.74 16.83,55.44 R18.1 13.25,62.1 Q8.C
N$48
  Bottom 0.203: R19.1 11.24,56.69 Q8.B
N$49  (via drill 1)
  other vias: 45.72,64.77
N$50  (via drill 1)
  other vias: 41.91,64.77
N$51  (via drill 1)
  other vias: 38.1,64.77
N$52  (via drill 1)
  other vias: 34.29,64.77
N$53  (via drill 1)
  other vias: 34.29,60.96
N$54  (via drill 1)
  other vias: 38.1,60.96
N$55  (via drill 1)
  other vias: 41.91,60.96
N$56  (via drill 1)
  other vias: 45.72,60.96
N$57  (via drill 1)
  other vias: 49.53,60.96
N$58  (via drill 1)
  other vias: 85.09,68.58
N$59  (via drill 1)
  other vias: 88.9,68.58
N$60  (via drill 1)
  other vias: 92.71,68.58
N$61  (via drill 1)
  other vias: 96.52,68.58
N$62  (via drill 1)
  other vias: 96.52,64.77
N$63  (via drill 1)
  other vias: 92.71,64.77
N$64  (via drill 1)
  other vias: 88.9,64.77
N$65  (via drill 1)
  other vias: 85.09,64.77
N$66  (via drill 1)
  other vias: 85.09,60.96
N$67  (via drill 1)
  other vias: 88.9,60.96
N$68  (via drill 1)
  other vias: 92.71,60.96
N$69  (via drill 1)
  other vias: 96.52,60.96
N$70  (via drill 1)
  other vias: 96.52,57.15
N$71  (via drill 1)
  other vias: 92.71,57.15
N$72  (via drill 1)
  other vias: 88.9,57.15
N$73  (via drill 1)
  other vias: 85.09,57.15
N$74  (via drill 1)
  other vias: 49.53,57.15
N$75  (via drill 1)
  other vias: 45.72,57.15
N$76  (via drill 1)
  other vias: 41.91,57.15
N$77  (via drill 1)
  other vias: 38.1,57.15
N$78  (via drill 1)
  other vias: 34.29,57.15
N$79  (via drill 1)
  other vias: 128.27,68.58
N$80  (via drill 1)
  other vias: 132.08,68.58
N$81  (via drill 1)
  other vias: 135.89,68.58
N$82  (via drill 1)
  other vias: 139.7,68.58
N$83  (via drill 1)
  other vias: 139.7,64.77
N$84  (via drill 1)
  other vias: 135.89,64.77
N$85  (via drill 1)
  other vias: 132.08,64.77
N$86  (via drill 1)
  other vias: 128.27,64.77
N$87  (via drill 1)
  other vias: 128.27,60.96
N$88  (via drill 1)
  other vias: 132.08,60.96
N$89  (via drill 1)
  other vias: 135.89,60.96
N$90  (via drill 1)
  other vias: 139.7,60.96
N$91  (via drill 1)
  other vias: 139.7,57.15
N$92  (via drill 1)
  other vias: 135.89,57.15
N$93  (via drill 1)
  other vias: 132.08,57.15
N$94  (via drill 1)
  other vias: 128.27,57.15
N$95  (via drill 1)
  other vias: 168.91,68.58
N$96  (via drill 1)
  other vias: 172.72,68.58
N$97  (via drill 1)
  other vias: 176.53,68.58
N$98  (via drill 1)
  other vias: 180.34,68.58
N$99  (via drill 1)
  other vias: 184.15,68.58
N$100  (via drill 1)
  other vias: 184.15,64.77
N$101  (via drill 1)
  other vias: 180.34,64.77
N$102  (via drill 1)
  other vias: 176.53,64.77
N$103  (via drill 1)
  other vias: 172.72,64.77
N$104  (via drill 1)
  other vias: 168.91,64.77
N$105  (via drill 1)
  other vias: 168.91,60.96
N$106  (via drill 1)
  other vias: 172.72,60.96
N$107  (via drill 1)
  other vias: 176.53,60.96
N$108  (via drill 1)
  other vias: 180.34,60.96
N$109  (via drill 1)
  other vias: 184.15,60.96
N$110  (via drill 1)
  other vias: 184.15,57.15
N$111  (via drill 1)
  other vias: 180.34,57.15
N$112  (via drill 1)
  other vias: 176.53,57.15
N$113  (via drill 1)
  other vias: 172.72,57.15
N$114  (via drill 1)
  other vias: 168.91,57.15
RED+  (via drill 0.35)
  Top 0.203: U5.13 200.13,33.63 200.15,33.66 v200.22,33.59
  Bottom 0.203: v200.22,33.59 220.79,33.59 222.12,32.26 222.12,26.04 221.62,25.53 LED1.A
  other vias: 220.76,25.53
RST
  Top 0.203: U5.29 208.94,34.44 209.3,34.8 209.3,43.43 JP2.2
RX
  Top 0.203: U5.30 206.58,35.23 205.99,35.81 205.99,36.96 206.88,37.85 206.88,39.5 203.58,42.8 JP2.4
SCL
  Top 0.203: U5.28 209.4,33.63 210.19,34.42 210.19,38.48 211.2,39.5 JP5.1
SDA
  Top 0.203: JP5.2 209.63,32.84 U5.27
THERM_ADC  (via drill 0.35)
  Top 0.203: U5.19 v201.88,35.1 | R33.1 199.77,48.58 | 199.77,48.58 213.55,48.58 v213.74,48.39 | JP1.2 199.77,53.72 199.77,48.58
  Bottom 0.203: v213.74,48.39 214.12,48.01 214.12,42.8 206.38,35.05 201.93,35.05 v201.88,35.1
THERM_PWR
  Top 0.203: U5.10 198.55,36.32 197.99,36.32 193.04,41.27 193.04,48.39 197.1,52.45 JP1.1
TX
  Top 0.203: JP2.3 206.12,42.8 208.53,40.39 208.53,36.32 208.25,36.04 U5.31
(copper drawn outside any net)
  shapes: Bottom area x2

### Text on the board
tPlace: 5V
tNames: CHARGE SWITCH | LOAD | INPUT | THERMISTOR | GND | RX | TX | RST | VCC | SCL | SDA | CHARGE | DISCHARGE | POWER | GND | GND
bNames: 4S2P Battery System / Designed by / Tuhin Sengupta